# EAGLE design driverboard-v3 (EAGLE 7.1.0)
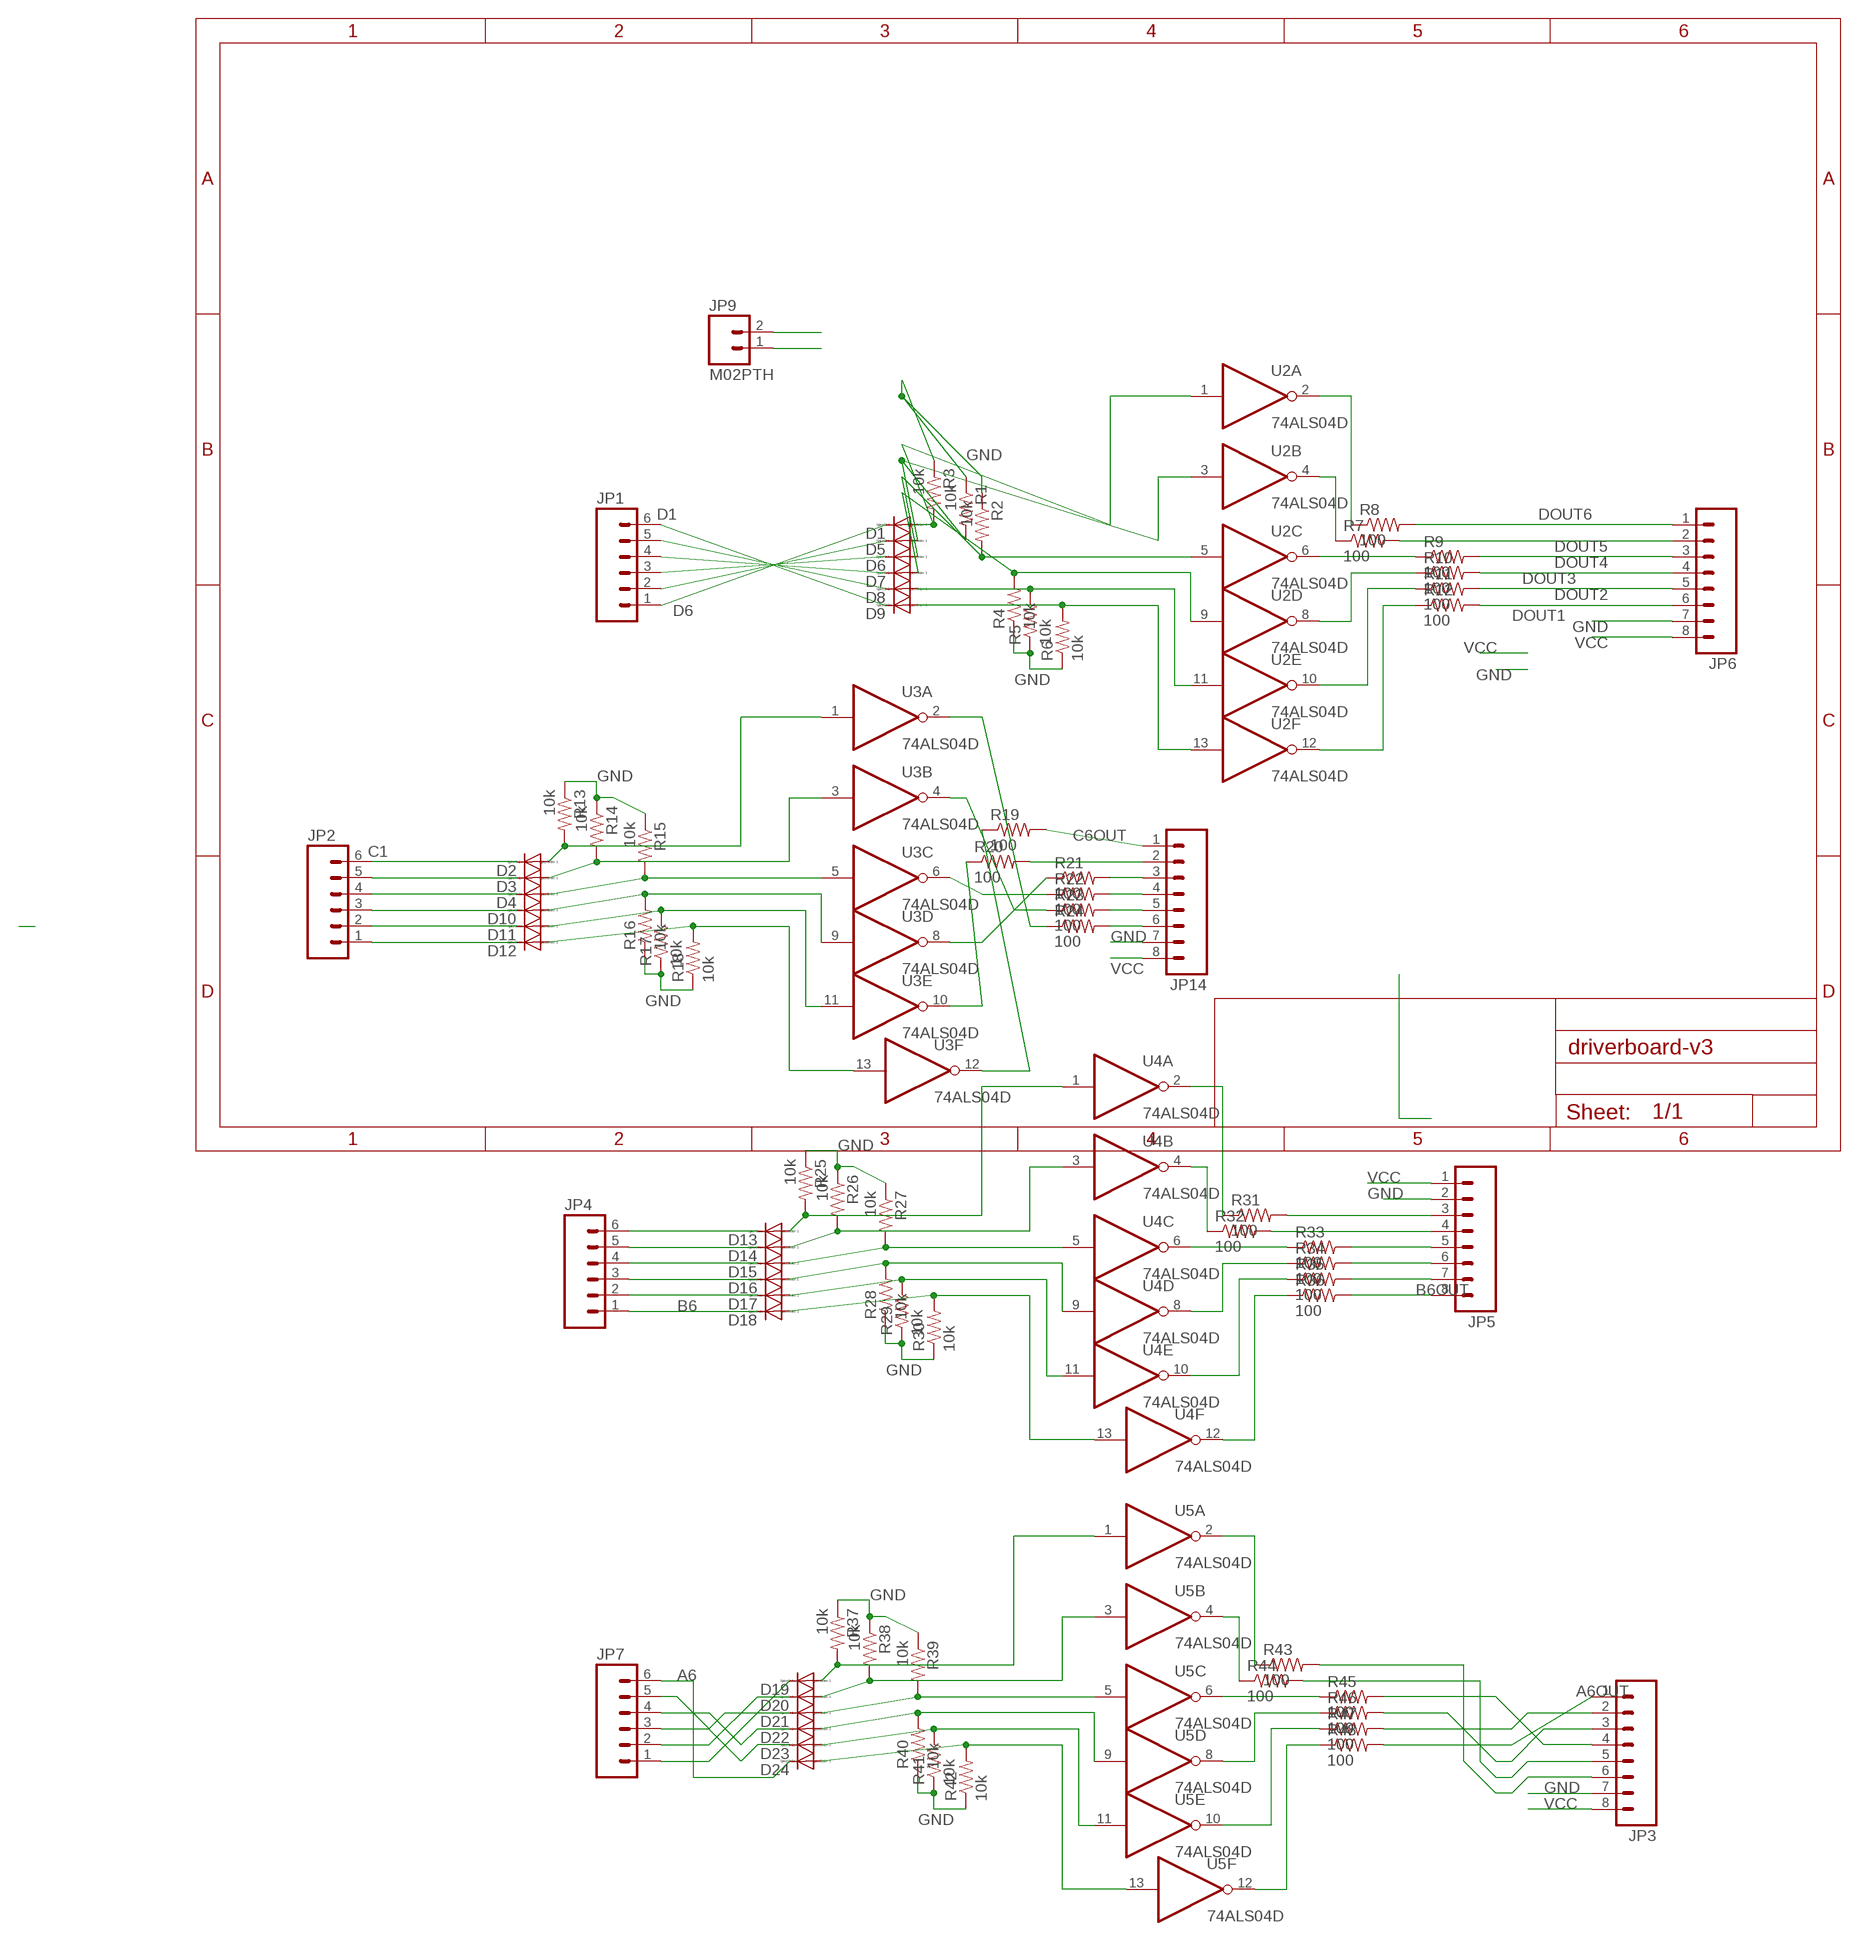
[diagram p0: schematic, sheet 1]

## Parts
D1  DIODE-DO-214AC  [DO-214AC]
D2  DIODE-DO-214AC  [DO-214AC]
D3  DIODE-DO-214AC  [DO-214AC]
D4  DIODE-DO-214AC  [DO-214AC]
D5  DIODE-DO-214AC  [DO-214AC]
D6  DIODE-DO-214AC  [DO-214AC]
D7  DIODE-DO-214AC  [DO-214AC]
D8  DIODE-DO-214AC  [DO-214AC]
D9  DIODE-DO-214AC  [DO-214AC]
D10  DIODE-DO-214AC  [DO-214AC]
D11  DIODE-DO-214AC  [DO-214AC]
D12  DIODE-DO-214AC  [DO-214AC]
D13  DIODE-DO-214AC  [DO-214AC]
D14  DIODE-DO-214AC  [DO-214AC]
D15  DIODE-DO-214AC  [DO-214AC]
D16  DIODE-DO-214AC  [DO-214AC]
D17  DIODE-DO-214AC  [DO-214AC]
D18  DIODE-DO-214AC  [DO-214AC]
D19  DIODE-DO-214AC  [DO-214AC]
D20  DIODE-DO-214AC  [DO-214AC]
D21  DIODE-DO-214AC  [DO-214AC]
D22  DIODE-DO-214AC  [DO-214AC]
D23  DIODE-DO-214AC  [DO-214AC]
D24  DIODE-DO-214AC  [DO-214AC]
JP1  M06NO_SILK  [1X06_NO_SILK]
JP2  M06NO_SILK  [1X06_NO_SILK]
JP3  M08NO_SILK  [1X08_NO_SILK]
JP4  M06NO_SILK  [1X06_NO_SILK]
JP5  M08NO_SILK  [1X08_NO_SILK]
JP6  M08NO_SILK  [1X08_NO_SILK]
JP7  M06NO_SILK  [1X06_NO_SILK]
JP9  M02PTH  [1X02]
JP14  M08NO_SILK  [1X08_NO_SILK]
R1  10k  RESISTOR0603  [0603-RES]
R2  10k  RESISTOR0603  [0603-RES]
R3  10k  RESISTOR0603  [0603-RES]
R4  10k  RESISTOR0603  [0603-RES]
R5  10k  RESISTOR0603  [0603-RES]
R6  10k  RESISTOR0603  [0603-RES]
R7  100  RESISTOR0603  [0603-RES]
R8  100  RESISTOR0603  [0603-RES]
R9  100  RESISTOR0603  [0603-RES]
R10  100  RESISTOR0603  [0603-RES]
R11  100  RESISTOR0603  [0603-RES]
R12  100  RESISTOR0603  [0603-RES]
R13  10k  RESISTOR0603  [0603-RES]
R14  10k  RESISTOR0603  [0603-RES]
R15  10k  RESISTOR0603  [0603-RES]
R16  10k  RESISTOR0603  [0603-RES]
R17  10k  RESISTOR0603  [0603-RES]
R18  10k  RESISTOR0603  [0603-RES]
R19  100  RESISTOR0603  [0603-RES]
R20  100  RESISTOR0603  [0603-RES]
R21  100  RESISTOR0603  [0603-RES]
R22  100  RESISTOR0603  [0603-RES]
R23  100  RESISTOR0603  [0603-RES]
R24  100  RESISTOR0603  [0603-RES]
R25  10k  RESISTOR0603  [0603-RES]
R26  10k  RESISTOR0603  [0603-RES]
R27  10k  RESISTOR0603  [0603-RES]
R28  10k  RESISTOR0603  [0603-RES]
R29  10k  RESISTOR0603  [0603-RES]
R30  10k  RESISTOR0603  [0603-RES]
R31  100  RESISTOR0603  [0603-RES]
R32  100  RESISTOR0603  [0603-RES]
R33  100  RESISTOR0603  [0603-RES]
R34  100  RESISTOR0603  [0603-RES]
R35  100  RESISTOR0603  [0603-RES]
R36  100  RESISTOR0603  [0603-RES]
R37  10k  RESISTOR0603  [0603-RES]
R38  10k  RESISTOR0603  [0603-RES]
R39  10k  RESISTOR0603  [0603-RES]
R40  10k  RESISTOR0603  [0603-RES]
R41  10k  RESISTOR0603  [0603-RES]
R42  10k  RESISTOR0603  [0603-RES]
R43  100  RESISTOR0603  [0603-RES]
R44  100  RESISTOR0603  [0603-RES]
R45  100  RESISTOR0603  [0603-RES]
R46  100  RESISTOR0603  [0603-RES]
R47  100  RESISTOR0603  [0603-RES]
R48  100  RESISTOR0603  [0603-RES]
U2  74ALS04D  [SO14]
U3  74ALS04D  [SO14]
U4  74ALS04D  [SO14]
U5  74ALS04D  [SO14]

## Nets
A1: D19.C JP7.1
A1OUT: JP3.6 R43.2
A2: D20.C JP7.2
A2OUT: JP3.5 R44.2
A3: D21.C JP7.3
A3OUT: JP3.4 R45.2
A4: D22.C JP7.4
A4OUT: JP3.3 R46.2
A5: D23.C JP7.5
A5OUT: JP3.2 R47.2
A6: D24.C JP7.6
A6OUT: JP3.1 R48.2
B1: D13.C JP4.6
B1OUT: JP5.3 R31.2
B2: D14.C JP4.5
B2OUT: JP5.4 R32.2
B3: D15.C JP4.4
B3OUT: JP5.5 R33.2
B4: D16.C JP4.3
B4OUT: JP5.6 R34.2
B5: D17.C JP4.2
B5OUT: JP5.7 R35.2
B6: D18.C JP4.1
B6OUT: JP5.8 R36.2
C1: D2.C JP2.6
C1OUT: JP14.6 R24.2
C2: D3.C JP2.5
C2OUT: JP14.5 R23.2
C3: D4.C JP2.4
C3OUT: JP14.4 R22.2
C4: D10.C JP2.3
C4OUT: JP14.3 R21.2
C5: D11.C JP2.2
C5OUT: JP14.2 R20.2
C6: D12.C JP2.1
C6OUT: JP14.1 R19.2
D1: D9.C JP1.6
D2: D8.C JP1.5
D3: D7.C JP1.4
D4: D6.C JP1.3
D5: D5.C JP1.2
D6: D1.C JP1.1
DOUT1: JP6.6 R12.2
DOUT2: JP6.5 R11.2
DOUT3: JP6.4 R10.2
DOUT4: JP6.3 R9.2
DOUT5: JP6.2 R7.2
DOUT6: JP6.1 R8.2
GND: JP3.7 JP5.2 JP6.7 JP9.1 JP14.7 R1.1 R2.1 R3.1 R4.1 R5.1 R6.1 R13.1 R14.1 R15.1 R16.1 R17.1 R18.1 R25.1 R26.1 R27.1 R28.1 R29.1 R30.1 R37.1 R38.1 R39.1 R40.1 R41.1 R42.1
N$2: R19.1 U3.12(F:O)
N$3: R20.1 U3.10(E:O)
N$4: R21.1 U3.8(D:O)
N$15: D1.A R3.2 U2.1(A:I)
N$16: D5.A R1.2 U2.3(B:I)
N$18: D7.A R4.2 U2.9(D:I)
N$21: R12.1 U2.12(F:O)
N$22: R11.1 U2.10(E:O)
N$23: R10.1 U2.8(D:O)
N$24: R9.1 U2.6(C:O)
N$25: R7.1 U2.4(B:O)
N$26: R8.1 U2.2(A:O)
N$28: D6.A R2.2 U2.5(C:I)
N$30: D8.A R5.2 U2.11(E:I)
N$31: D9.A R6.2 U2.13(F:I)
N$35: D3.A R14.2 U3.3(B:I)
N$36: D10.A R16.2 U3.9(D:I)
N$39: R22.1 U3.6(C:O)
N$41: R23.1 U3.4(B:O)
N$42: R24.1 U3.2(A:O)
N$49: D2.A R13.2 U3.1(A:I)
N$50: D4.A R15.2 U3.5(C:I)
N$51: D11.A R17.2 U3.11(E:I)
N$52: D12.A R18.2 U3.13(F:I)
N$60: D14.A R26.2 U4.3(B:I)
N$61: D16.A R28.2 U4.9(D:I)
N$62: R36.1 U4.12(F:O)
N$64: R35.1 U4.10(E:O)
N$65: R34.1 U4.8(D:O)
N$66: R33.1 U4.6(C:O)
N$67: R32.1 U4.4(B:O)
N$68: R31.1 U4.2(A:O)
N$75: D13.A R25.2 U4.1(A:I)
N$76: D15.A R27.2 U4.5(C:I)
N$77: D17.A R29.2 U4.11(E:I)
N$78: D18.A R30.2 U4.13(F:I)
N$86: D20.A R38.2 U5.3(B:I)
N$87: D22.A R40.2 U5.9(D:I)
N$88: R48.1 U5.12(F:O)
N$89: R47.1 U5.10(E:O)
N$90: R46.1 U5.8(D:O)
N$91: R45.1 U5.6(C:O)
N$92: R44.1 U5.4(B:O)
N$93: R43.1 U5.2(A:O)
N$100: D19.A R37.2 U5.1(A:I)
N$101: D21.A R39.2 U5.5(C:I)
N$102: D23.A R41.2 U5.11(E:I)
N$103: D24.A R42.2 U5.13(F:I)
VCC: JP3.8 JP5.1 JP6.8 JP9.2 JP14.8

## Power pins joined to a net without a drawn wire
GND: U2.7(P:GND) U3.7(P:GND) U4.7(P:GND) U5.7(P:GND)
VCC: U2.14(P:VCC) U3.14(P:VCC) U4.14(P:VCC) U5.14(P:VCC)

## Library data of the parts
D1-D24 = diode:DIODE-: DIODE
JP1 JP2 JP4 JP7 = SparkFun-Connectors:M06: Header 6 Standard 6-pin 0.1" header. Use with straight break away headers (SKU : PRT-00116), right angle break away headers (PRT-00553), swiss pins (PRT-00743), machine pins (PRT-00117), and female headers (PRT-00115). Molex polarized connector foot print use with SKU : PRT-08094 with associated crimp pins and housings. NOTES ON THE VARIANTS LOCK and LOCK_LONGPADS... This footprint was designed to help hold the alignment of a through-hole component (i.e. 6-pin header) while soldering it into place. You may notice that each hole has been shifted either up or down by 0.005 of an inch from it's more standard position (which is a perfectly straight line). This slight alteration caused the pins (the squares in the middle) to touch the edges of the holes. Because they are alternating, it causes a "brace" to hold the component in place. 0.005 has proven to be the perfect amount of "off-center" position when using our standard breakaway headers. Although looks a little odd when you look at the bare footprint, once you have a header in there, the alteration is very hard to notice. Also,if you push a header all the way into place, it is covered up entirely on the bottom side. This idea of altering the position of holes to aid alignment will be further integrated into the Sparkfun Library for other footprints. It can help hold any component with 3 or more connection pins.
JP3 JP5 JP6 JP14 = SparkFun-Connectors:M08: Header 8 Standard 8-pin 0.1" header. Use with straight break away headers (SKU : PRT-00116), right angle break away headers (PRT-00553), swiss pins (PRT-00743), machine pins (PRT-00117), and female headers (PRT-00115).
JP9 = SparkFun-Connectors:M02: Standard 2-pin 0.1" header. Use with - straight break away headers ( PRT-00116) - right angle break away headers (PRT-00553) - swiss pins (PRT-00743) - machine pins (PRT-00117) - female headers (PRT-00115) Molex polarized connector foot print use with: PRT-08233 with associated crimp pins and housings. 2.54_SCREWTERM for use with PRT-10571. 3.5mm Screw Terminal footprints for PRT-08084 5mm Screw Terminal footprints for use with PRT-08432
R1-R48 = SparkFun-Resistors:RESISTOR: Resistor Basic schematic elements and footprints for 0603, 1206, and PTH resistors.
U2-U5 = 74xx-us:74*04: Hex INVERTER

## Net classes
1 vcc: width 0.254 mm

## Board
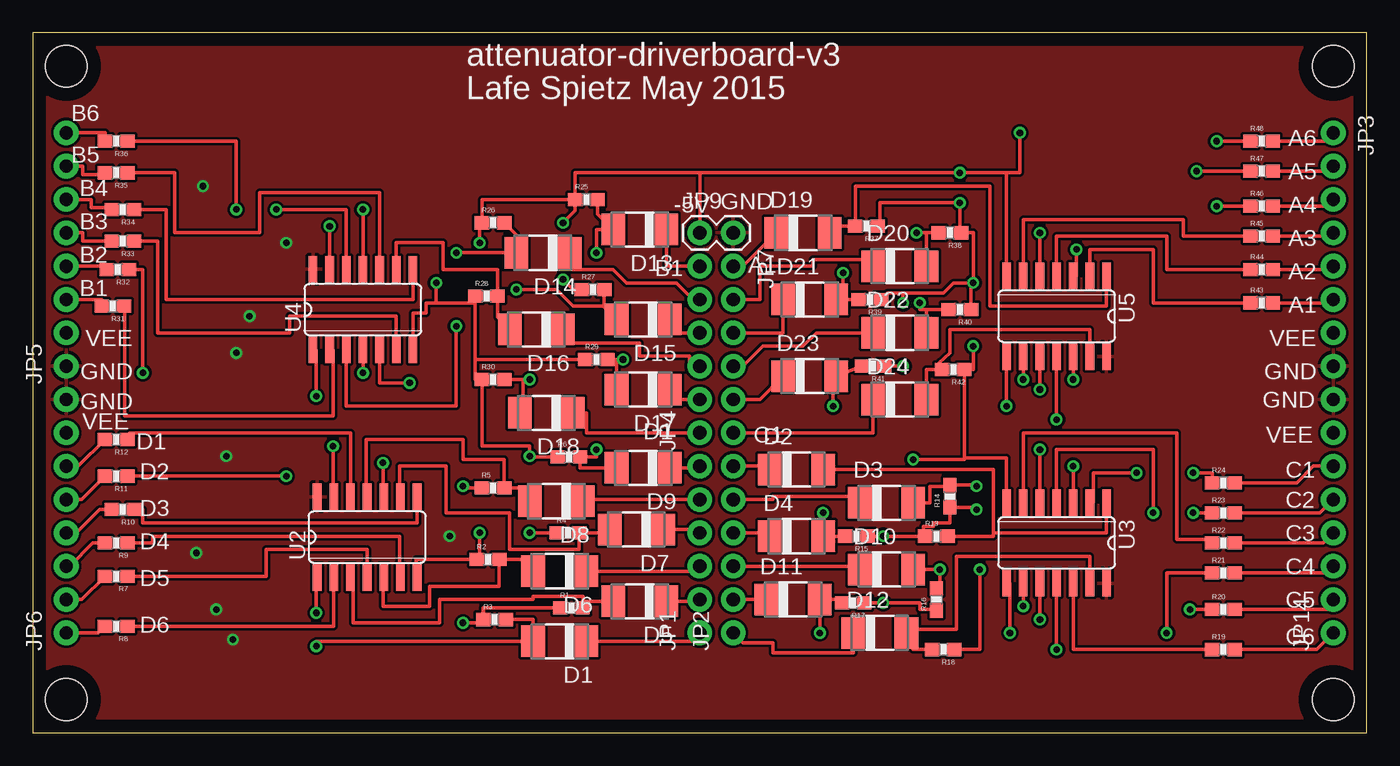
[diagram p1: board, top side]
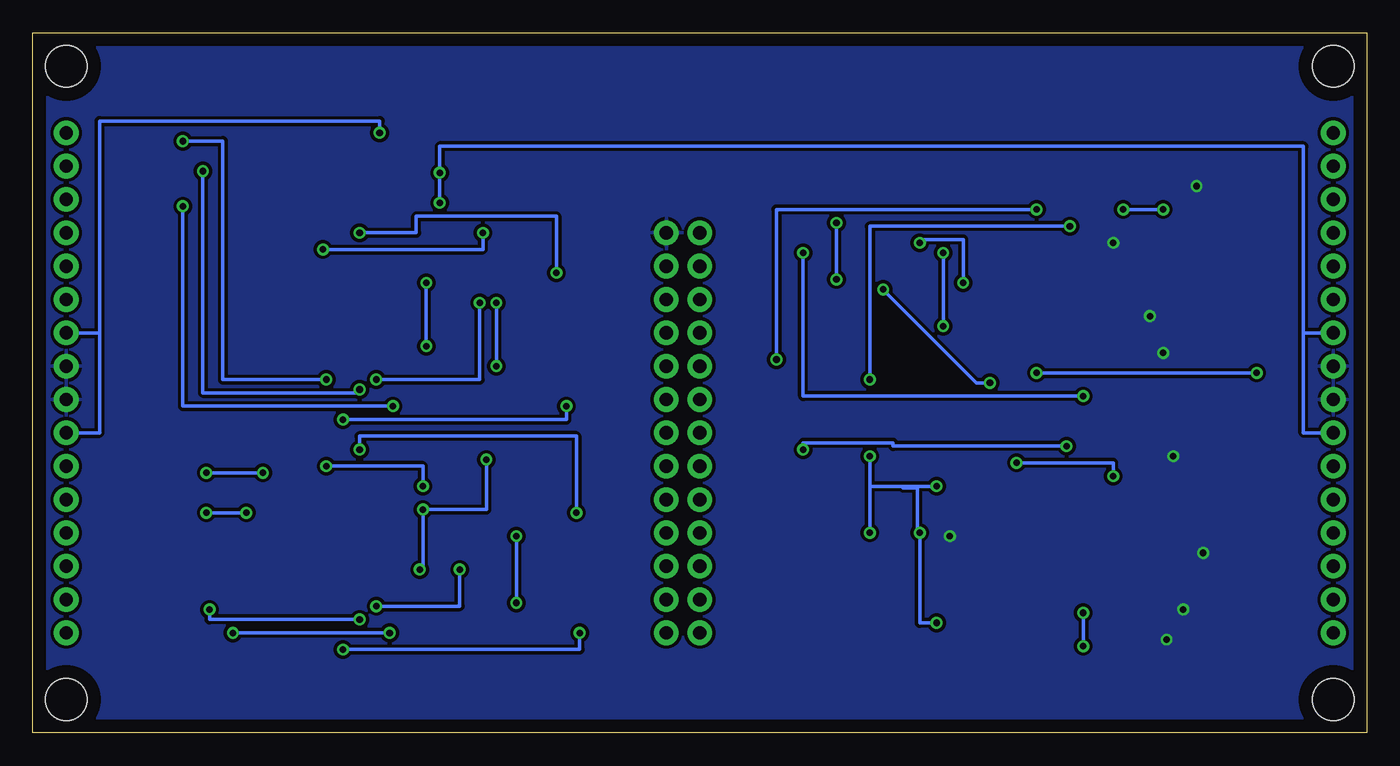
[diagram p2: board, bottom side, seen from below]

Size 101.6 x 53.34 mm. Coordinates in mm from the lower left corner, seen from the top.
Outline: 0,0 101.6,0 101.6,53.34 0,53.34 0,0
Copper layers (1*16): Top 0.035mm / dielectric 1.5mm / Bottom 0.035mm
Design rules "default": minimum track width 10mil, minimum drill 24mil, track to track 8mil, track to pad 8mil, pad to pad 8mil, via to via 8mil, smd to smd 8mil, copper to edge 40mil, drill to drill 8mil, minimum pad ring 10mil, minimum via ring 8mil, stop-mask expansion 4mil, vias tented up to drill 0mil, thermal gap 10mil
Holes 3.2 mm at 2.54,50.8 99.06,50.8 99.06,2.54 2.54,2.54

### Footprints (pad centres in the part's own frame; a part is rotated, then mirrored left to right if it is on the bottom)
DO-214AC = smd 1.8 x 2.4: A 2.025,0; C -2.025,0
1X06_NO_SILK = drill 1.016 pad 1.88: 1 0,0; 2 2.54,0; 3 5.08,0; 4 7.62,0; 5 10.16,0; 6 12.7,0
1X08_NO_SILK = drill 1.016 pad 1.88: 1 0,0; 2 2.54,0; 3 5.08,0; 4 7.62,0; 5 10.16,0; 6 12.7,0; 7 15.24,0; 8 17.78,0
1X02 = drill 1.016 pad 1.88: 1 0,0; 2 2.54,0
0603-RES = smd 1.1 x 1: 1 -0.85,0; 2 0.85,0
SO14 = smd 0.66 x 2.032: 1 -3.81,-3.073; 2 -2.54,-3.073; 3 -1.27,-3.073; 4 0,-3.073; 5 1.27,-3.073; 6 2.54,-3.073; 7 3.81,-3.073; 8 3.81,3.073; 9 2.54,3.073; 10 1.27,3.073; 11 0,3.073; 12 -1.27,3.073; 13 -2.54,3.073; 14 -3.81,3.073

### Placement (x,y rotation side)
D1  40.13,6.99 180 top
D2  58.17,20.07 0 top
D3  65.02,17.53 0 top
D4  58.17,14.99 0 top
D5  46.23,10.03 180 top
D6  40.13,12.32 180 top
D7  45.97,15.49 180 top
D8  39.88,17.65 180 top
D9  46.48,20.19 180 top
D10  65.02,12.45 0 top
D11  57.91,10.16 0 top
D12  64.52,7.62 0 top
D13  46.23,38.35 180 top
D14  38.86,36.58 180 top
D15  46.48,31.5 180 top
D16  38.35,30.73 180 top
D17  46.48,26.16 180 top
D18  39.12,24.38 180 top
D19  58.67,38.1 0 top
D20  66.04,35.56 0 top
D21  59.18,33.02 0 top
D22  66.04,30.48 0 top
D23  59.18,27.18 0 top
D24  66.04,25.4 0 top
JP1  50.8,7.62 90 top
JP2  53.34,7.62 90 top
JP3  99.06,45.72 270 top
JP4  50.8,22.86 90 top
JP5  2.54,27.94 90 top
JP6  2.54,7.62 90 top
JP7  53.34,35.56 270 top
JP9  50.8,38.1 0 top
JP14  99.06,7.62 90 top
R1  41.02,9.53 0 top
R2  34.67,13.21 0 top
R3  35.18,8.64 0 top
R4  40.77,15.24 0 top
R5  35.05,18.67 0 top
R6  40.83,21.02 0 top
R7  6.35,11.94 180 top
R8  6.35,8.13 180 top
R9  6.35,14.48 180 top
R10  6.86,17.02 180 top
R11  6.35,19.56 180 top
R12  6.35,22.35 180 top
R13  68.83,14.99 0 top
R14  69.85,18.03 90 top
R15  62.74,14.99 180 top
R16  68.83,10.16 90 top
R17  62.48,9.91 180 top
R18  69.34,6.35 180 top
R19  90.68,6.35 0 top
R20  90.68,9.4 0 top
R21  90.68,12.19 0 top
R22  90.68,14.48 0 top
R23  90.68,16.76 0 top
R24  90.68,19.05 0 top
R25  42.16,40.64 0 top
R26  35.05,38.86 0 top
R27  42.67,33.78 0 top
R28  34.54,33.27 0 top
R29  42.93,28.45 0 top
R30  35.05,26.92 0 top
R31  6.1,32.51 180 top
R32  6.48,35.31 180 top
R33  6.86,37.47 180 top
R34  6.86,39.88 180 top
R35  6.35,42.67 180 top
R36  6.35,45.09 180 top
R37  63.5,38.61 180 top
R38  69.85,38.1 180 top
R39  63.75,33.02 180 top
R40  70.61,32.26 180 top
R41  64.01,27.94 180 top
R42  70.1,27.69 180 top
R43  93.6,32.77 0 top
R44  93.6,35.31 0 top
R45  93.6,37.85 0 top
R46  93.6,40.13 0 top
R47  93.6,42.8 0 top
R48  93.6,45.09 0 top
U2  25.46,14.92 0 top
U3  77.98,14.48 180 top
U4  25.15,32.26 0 top
U5  77.98,31.75 180 top

### Tracks (layer width: path | path; a pad name or v marks a point on that pad's centre or on a via)
A1
  Top 0.254: JP7.1 54.11,35.56 D19.C
A1OUT
  Top 0.254: R43.2 98.81,32.77 JP3.6
A2
  Top 0.254: JP7.2 55.37,33.02 55.37,35.56 59.44,35.56 59.44,36.07 64.02,36.07 D20.C
A2OUT
  Top 0.254: R44.2 98.81,35.31 JP3.5
A3
  Top 0.254: JP7.3 57.16,30.48 D21.C
A3OUT
  Top 0.254: R45.2 98.81,37.85 JP3.4
A4
  Top 0.254: JP7.4 54.1,27.94 55.63,29.46 58.67,29.46 59.69,30.48 D22.C
A4OUT
  Top 0.254: R46.2 98.55,40.13 JP3.3
A5
  Top 0.254: JP7.5 55.38,25.4 D23.C
A5OUT
  Top 0.254: R47.2 98.68,42.8 JP3.2
A6
  Top 0.254: JP7.6 64.01,22.86 64.01,25.39 D24.C
A6OUT
  Top 0.254: R48.2 98.42,45.09 JP3.1
B1
  Top 0.254: D13.C 48.26,35.56 JP4.6
B1OUT
  Top 0.254: JP5.3 5.25,33.02 R31.2
B2
  Top 0.254: JP4.5 50.29,33.02 49.02,34.29 45.21,34.29 44.2,35.31 40.89,35.31 D14.C
B2OUT
  Top 0.254: JP5.4 5.63,35.56 R32.2
B3
  Top 0.254: JP4.4 48.51,30.48 D15.C
B3OUT
  Top 0.254: JP5.5 3.81,38.1 3.81,37.47 R33.2
B4
  Top 0.254: JP4.3 50.04,27.94 50.04,28.7 46.23,28.7 46.23,29.72 40.38,29.72 D16.C
B4OUT
  Top 0.254: JP5.6 4.45,40.64 4.45,40.01 6.01,40.01 R34.2
B5
  Top 0.254: JP4.2 48.51,25.4 D17.C
B5OUT
  Top 0.254: JP5.7 3.81,43.18 3.81,42.55 5.5,42.55 R35.2
B6
  Top 0.254: D18.C 42.16,24.38 42.16,22.86 JP4.1
B6OUT
  Top 0.254: JP5.8 5.5,45.72 R36.2
C1
  Top 0.254: JP2.6 56.14,20.32 D2.C
C1OUT
  Top 0.254: R24.2 96.27,19.05 97.54,20.32 JP14.6
C2
  Top 0.254: JP2.5 56.39,17.78 56.39,18.03 63,18.03 D3.C
C2OUT
  Top 0.254: R23.2 98.04,16.76 JP14.5
C3
  Top 0.254: JP2.4 56.14,15.24 D4.C
C3OUT
  Top 0.254: R22.2 98.3,14.48 JP14.4
C4
  Top 0.254: JP2.3 63,12.7 D10.C
C4OUT
  Top 0.254: R21.2 98.55,12.19 JP14.3
C5
  Top 0.254: JP2.2 D11.C
C5OUT
  Top 0.254: R20.2 99.06,9.4 JP14.2
C6
  Top 0.254: JP2.1 54.1,6.86 56.39,6.86 56.39,6.1 62.49,6.1 D12.C
C6OUT
  Top 0.254: R19.2 97.79,6.35 JP14.1
D1
  Top 0.254: D9.C 50.8,20.19 JP1.6
D2
  Top 0.254: JP1.5 41.9,17.78 D8.C
D3
  Top 0.254: D7.C 50.8,15.49 JP1.4
D4
  Top 0.254: D6.C 50.8,12.32 JP1.3
D5
  Top 0.254: D5.C 50.8,10.03 JP1.2
D6
  Top 0.254: D1.C 50.8,6.99 JP1.1
DOUT1
  Top 0.254: JP6.6 3.47,20.32 R12.2
DOUT2
  Top 0.254: JP6.5 3.72,17.78 R11.2
DOUT3
  Top 0.254: JP6.4 3.3,15.24 5.08,17.02 R10.2
DOUT4
  Top 0.254: JP6.3 2.79,12.7 4.57,14.48 R9.2
DOUT5
  Top 0.254: JP6.2 3.72,10.16 R7.2
DOUT6
  Top 0.254: JP6.1 4.99,7.62 R8.2
GND  (via drill 0.5)
  Top 0.254: U2.7 29.21,11.85 29.21,13.21 R2.1 34.04,13.21 v34.04,15.24 | R1.1 34.33,9.53 | 34.33,9.53 R3.1 | R4.1 v37.85,15.24 | R6.1 37.85,21.02 v37.85,21.08 37.85,21.84 34.2,21.84 R30.1 33.69,26.92 33.69,28.45 | R5.1 32.77,18.67 v32.77,18.8 | 34.33,9.53 34.29,9.53 34.29,8.38 v32.77,8.38 | R17.1 v64.77,9.91 67.56,9.91 67.56,9.4 68.83,9.4 R16.1 | R15.1 v64.77,14.99 R13.1 67.82,14.99 67.82,15.75 68.58,15.75 68.58,16 69.85,16 R14.1 71.88,17.18 v71.88,17.02 | U3.7 74.17,20.95 70.95,20.95 | 70.95,20.95 R42.1 71.63,27.69 v71.63,29.46 | v71.63,34.29 71.46,34.29 R40.1 | v71.63,34.29 71.63,38.1 R38.1 70.61,38.1 v70.61,40.39 64.52,40.39 64.52,38.61 R37.1 | v67.06,20.83 70.95,20.83 70.95,20.95 | R18.1 72.14,6.35 v72.14,12.45 | 33.69,28.45 R28.1 | U4.7 28.96,32 29.97,32 29.97,32.77 30.73,32.77 | 33.53,32.77 33.69,32.77 R28.1 | R28.1 33.53,33.27 33.53,32.77 | 33.53,32.77 30.73,32.77 | 30.73,32.77 v30.73,34.29 | v34.04,37.34 34.04,38.86 R26.1 34.2,40.64 R25.1 | R29.1 33.69,28.45 | R27.1 41.15,33.78 v40.39,34.54 | R25.1 41.31,39.79 v40.39,38.86 | v71.63,34.29 70.1,34.29 69.34,33.53 66.29,33.53 | 66.29,33.53 65.11,33.53 R39.1 | R41.1 v66.29,27.94 | v66.29,32.77 66.29,33.53 | U5.7 74.17,42.67 | 74.17,42.67 v70.61,42.67 50.8,42.67 | 50.8,42.67 41.31,42.67 R25.1 | JP9.1 50.8,42.67 | 74.17,42.67 75.18,42.67 v75.18,45.72
  Bottom 0.254: v37.85,15.24 37.85,18.8 | 37.85,18.8 v37.85,21.08 | v32.77,18.8 35.31,18.8 | 35.31,18.8 37.85,18.8 | 35.31,18.8 35.31,18.67 R5.1 34.2,15.24 v34.04,15.24 34.04,8.38 v32.77,8.38 | v64.77,9.91 v64.77,14.99 | v71.63,29.46 v71.63,34.29 | v67.06,20.83 67.06,17.02 v71.88,17.02 71.88,12.45 v72.14,12.45 | v30.73,34.29 30.73,37.59 34.04,37.59 v34.04,37.34 | v40.39,34.54 v40.39,38.86 | v66.29,27.94 v66.29,32.77 | v70.61,40.39 v70.61,42.67 | 70.61,43.18 v70.61,42.67 | 4.83,30.48 4.83,22.86 JP6.7 | 4.83,30.48 4.83,44.7 70.61,44.7 v70.61,42.67 | JP3.7 96.52,30.48 | 96.52,30.48 96.52,46.61 75.18,46.61 v75.18,45.72 | JP5.2 4.83,30.48 | JP14.7 96.52,22.86 96.52,30.48
N$2
  Top 0.254: U3.12 79.25,6.35 R19.1
N$3  (via drill 0.5)
  Top 0.254: U3.10 v76.71,8.64 | R20.1 v88.14,9.4
  Bottom 0.254: v76.71,8.64 88.14,8.64 v88.14,9.4
N$4  (via drill 0.5)
  Top 0.254: U3.8 74.42,11.4 v74.42,7.62 | v86.36,7.62 86.36,12.19 R21.1
  Bottom 0.254: v74.42,7.62 v86.36,7.62
N$15  (via drill 0.5)
  Top 0.254: U2.1 21.59,11.85 v21.59,9.14 | v21.59,6.6 21.59,6.99 D1.A 38.11,8.64 R3.2
  Bottom 0.254: v21.59,9.14 v21.59,6.6
N$16
  Top 0.254: D5.A 41.91,10.03 | R1.2 41.87,10.03 41.91,10.03 | 41.91,10.03 41.91,10.41 38.1,10.41 38.1,10.16 30.99,10.16 30.99,8.38 24.38,8.38 24.38,11.85 U2.3
N$18
  Top 0.254: U2.9 27.94,18 27.94,20.32 31.5,20.32 31.5,16.76 36.32,16.76 36.32,13.97 41.62,13.97 R4.2 43.95,15.24 D7.A
N$21
  Top 0.254: U2.12 24.19,22.86 7.37,22.86 R12.1
N$22  (via drill 0.5)
  Top 0.254: R11.1 v19.3,19.56 | U2.10 26.67,18 v26.67,20.57
  Bottom 0.254: v19.3,19.56 19.3,20.57 v26.67,20.57
N$23
  Top 0.254: U2.8 29.27,16 8.38,16 8.38,17.02 R10.1
N$24
  Top 0.254: U2.6 27.94,11.85 27.94,14.99 9.14,14.99 9.14,14.48 R9.1
N$25
  Top 0.254: R7.1 17.78,11.94 17.78,13.97 25.46,13.97 U2.4
N$26
  Top 0.254: R8.1 22.92,8.13 U2.2
N$28
  Top 0.254: 37.85,11.43 37.85,12.32 D6.A 38.11,13.21 R2.2 35.52,11.18 30.23,11.18 30.23,9.65 26.67,9.65 26.67,11.85 U2.5
N$30
  Top 0.254: U2.11 25.4,18 25.4,22.35 32.77,22.35 32.77,20.83 35.9,20.83 R5.2 37.85,18.67 D8.A
N$31  (via drill 0.5)
  Top 0.254: U2.13 22.86,18 v22.86,21.84 | D9.A 41.68,20.19 R6.2 42.93,21.02 v42.93,21.59
  Bottom 0.254: v22.86,21.84 36.07,21.84 36.07,22.1 42.93,22.1 v42.93,21.59
N$35  (via drill 0.5)
  Top 0.254: D3.A 66.8,17.53 | D3.A | D3.A 68.33,17.53 68.33,18.8 69.85,18.8 R14.2 71.88,18.88 v71.88,18.8 | U3.3 v79.25,20.32
  Bottom 0.254: v71.88,18.8 71.88,20.32 v79.25,20.32
N$36  (via drill 0.5)
  Top 0.254: 75.44,11.91 U3.9 v75.44,9.65 | D10.A v69.09,12.45 69.09,11.01 R16.2
  Bottom 0.254: v75.44,9.65 69.09,9.65 v69.09,12.45
N$39
  Top 0.254: U3.6 75.44,22.86 87.12,22.86 87.12,14.73 89.83,14.73 R22.1
N$41  (via drill 0.5)
  Top 0.254: U3.4 77.98,21.59 85.34,21.59 v85.34,16.76 | v88.39,16.76 R23.1
  Bottom 0.254: v85.34,16.76 v88.39,16.76
N$42  (via drill 0.5)
  Top 0.254: U3.2 80.77,17.55 80.77,19.81 v84.07,19.81 | v88.39,19.81 89.83,19.81 R24.1
  Bottom 0.254: v84.07,19.81 v88.39,19.81
N$49
  Top 0.254: U3.1 81.79,15.24 73.15,15.24 | 73.15,15.24 73.15,20.07 D2.A | R13.2 73.15,14.99 73.15,15.24
N$50  (via drill 0.5)
  Top 0.254: U3.5 v76.71,21.59 | v60.2,16.76 D4.A R15.2
  Bottom 0.254: v60.2,16.76 60.2,22.61 76.71,22.61 v76.71,21.59
N$51  (via drill 0.5)
  Top 0.254: U3.11 v77.98,6.35 | v59.94,7.62 D11.A 61.63,10.16 R17.2
  Bottom 0.254: v77.98,6.35 59.94,6.35 v59.94,7.62
N$52
  Top 0.254: U3.13 80.52,13.46 70.36,13.46 70.36,7.87 67.06,7.87 | 67.06,7.87 D12.A | R18.2 67.06,6.35 67.06,7.87
N$60  (via drill 0.5)
  Top 0.254: U4.3 23.88,24.89 32.26,24.89 v32.26,30.99 | R26.2 36.84,37.93 D14.A v32.26,36.58
  Bottom 0.254: v32.26,30.99 v32.26,36.58
N$61
  Top 0.254: U4.9 27.69,37.34 31.24,37.34 31.24,35.31 35.39,35.31 R28.2 35.39,31.67 D16.A
N$62  (via drill 0.5)
  Top 0.254: U4.12 23.88,39.88 v18.54,39.88 | R36.1 15.49,45.09 v15.49,39.88
  Bottom 0.254: v18.54,39.88 v15.49,39.88
N$64
  Top 0.254: U4.10 26.42,41.15 17.27,41.15 17.27,38.1 10.79,38.1 10.79,42.67 R35.1
N$65
  Top 0.254: U4.8 28.96,33.02 10.16,33.02 10.16,39.88 R34.1
N$66
  Top 0.254: U4.6 27.69,31.75 19.56,31.75 19.56,30.48 9.53,30.48 9.53,37.47 R33.1
N$67  (via drill 0.5)
  Top 0.254: U4.4 v25.15,27.43 | R32.1 8.38,35.31 v8.38,27.43
  Bottom 0.254: v25.15,27.43 v8.38,27.43
N$68
  Top 0.254: U4.2 22.86,29.18 22.86,24.13 6.99,24.13 6.99,32.51 R31.1
N$75  (via drill 0.5)
  Top 0.254: U4.1 21.59,29.18 v21.59,25.65 | v42.93,36.58 42.93,38.35 D13.A 43.01,39.54 R25.2
  Bottom 0.254: v21.59,25.65 42.93,25.65 v42.93,36.58
N$76  (via drill 0.5)
  Top 0.254: U4.5 26.42,26.67 v28.7,26.67 | v36.83,33.78 39.88,33.78 41.15,32.51 43.44,32.51 | 43.44,32.51 D15.A | R27.2 43.52,32.59 43.44,32.51
  Bottom 0.254: v28.7,26.67 29.72,26.67 v36.83,33.78
N$77  (via drill 0.5)
  Top 0.254: U4.11 v25.15,39.88 | v44.96,28.45 R29.2 44.46,28.45 D17.A
  Bottom 0.254: v25.15,39.88 44.96,39.88 v44.96,28.45
N$78  (via drill 0.5)
  Top 0.254: U4.13 v22.61,38.61 | R30.2 37.34,26.92 | 37.34,26.92 v37.85,26.92 | D18.A 37.34,24.38 37.34,26.92
  Bottom 0.254: v22.61,38.61 37.85,38.61 v37.85,26.92
N$86  (via drill 0.5)
  Top 0.254: R38.2 68.06,38.1 | 68.06,38.1 D20.A | U5.3 79.5,34.82 v79.5,36.83 | v67.31,38.1 68.06,38.1
  Bottom 0.254: v79.5,36.83 67.31,36.83 v67.31,38.1
N$87  (via drill 0.5)
  Top 0.254: R40.2 68.06,32.26 | 68.06,32.26 D22.A | U5.9 v75.44,26.92 | 68.06,32.26 67.56,32.26 v67.56,32.77
  Bottom 0.254: v75.44,26.92 67.56,26.92 v67.56,32.77
N$88  (via drill 0.5)
  Top 0.254: R48.1 v90.17,45.09 | v79.25,26.92 U5.12
  Bottom 0.254: v90.17,45.09 87.12,45.09 87.12,26.92 v79.25,26.92
N$89  (via drill 0.5)
  Top 0.254: R47.1 v88.65,42.8 | v76.71,26.16 U5.10
  Bottom 0.254: v88.65,42.8 88.65,25.91 76.71,25.91 v76.71,26.16
N$90  (via drill 0.5)
  Top 0.254: R46.1 v90.17,40.13 | U5.8 v74.17,24.89
  Bottom 0.254: v90.17,40.13 90.17,24.89 v74.17,24.89
N$91
  Top 0.254: R45.1 87.63,37.85 87.63,39.12 75.44,39.12 U5.6
N$92
  Top 0.254: R44.1 86.36,35.31 86.36,37.85 77.98,37.85 U5.4
N$93
  Top 0.254: R43.1 85.34,32.77 85.34,36.83 80.52,36.83 U5.2
N$100
  Top 0.254: U5.1 81.79,32.51 72.9,32.51 72.9,41.66 62.65,41.66 R37.2 60.96,38.61 60.96,37.59 60.7,37.59 D19.A
N$101  (via drill 0.5)
  Top 0.254: D21.A 61.72,33.02 | 61.72,33.02 R39.2 | U5.5 v76.71,38.1 | v61.72,35.05 61.72,33.02
  Bottom 0.254: v76.71,38.1 72.39,38.1 72.39,39.37 61.72,39.37 v61.72,35.05
N$102  (via drill 0.5)
  Top 0.254: R41.2 D23.A 60.96,27.94 v60.96,24.89 | U5.11 v77.98,23.88
  Bottom 0.254: v77.98,23.88 60.96,23.88 v60.96,24.89
N$103
  Top 0.254: D24.A 68.06,27.69 R42.2 69,28.19 69.85,28.96 69.85,30.73 80.52,30.73 U5.13
VCC  (via drill 0.5)
  other vias: 31.75,14.99 14.73,21.08 15.49,28.96 16.51,31.75 19.3,37.34 12.45,13.72 13.97,9.4 15.24,7.11 12.95,41.66
  pour Top (isolate 0.152): -19.05,59.18 -17.53,-18.54 116.59,-16.26 116.59,59.94
  pour Bottom (isolate 0.254): -7.62,57.28 -7.37,-15.24 107.44,-13.21 107.7,57.28

### Text on the board
tPlace: attenuator-driverboard-v3 | B6 | Lafe Spietz May 2015 | A6 | B5 | A5 | B4 | -5V | GND | A4 | B3 | A3 | B2 | B1 | A1 | A2 | B1 | A1 | VEE | VEE | GND | GND | GND | GND | VEE | D1 | D1 | C1 | VEE | D2 | C1 | D3 | C2 | C3 | D4 | C4 | D5 | C5 | D6 | C6